# EasyEDA Pro project 一体板.epro, board PCB3
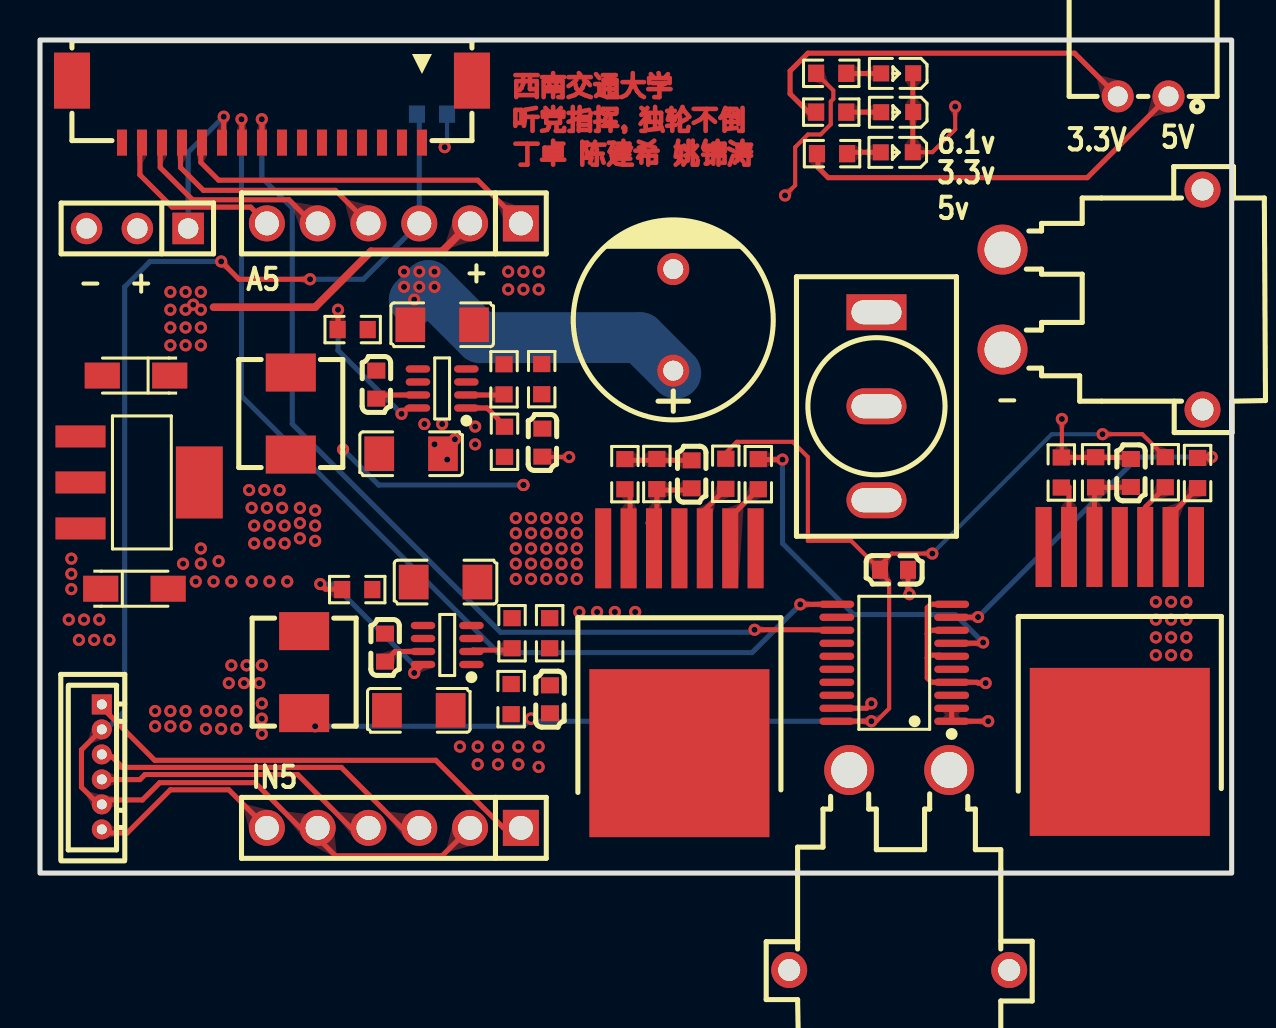
[diagram p17: board, top side]
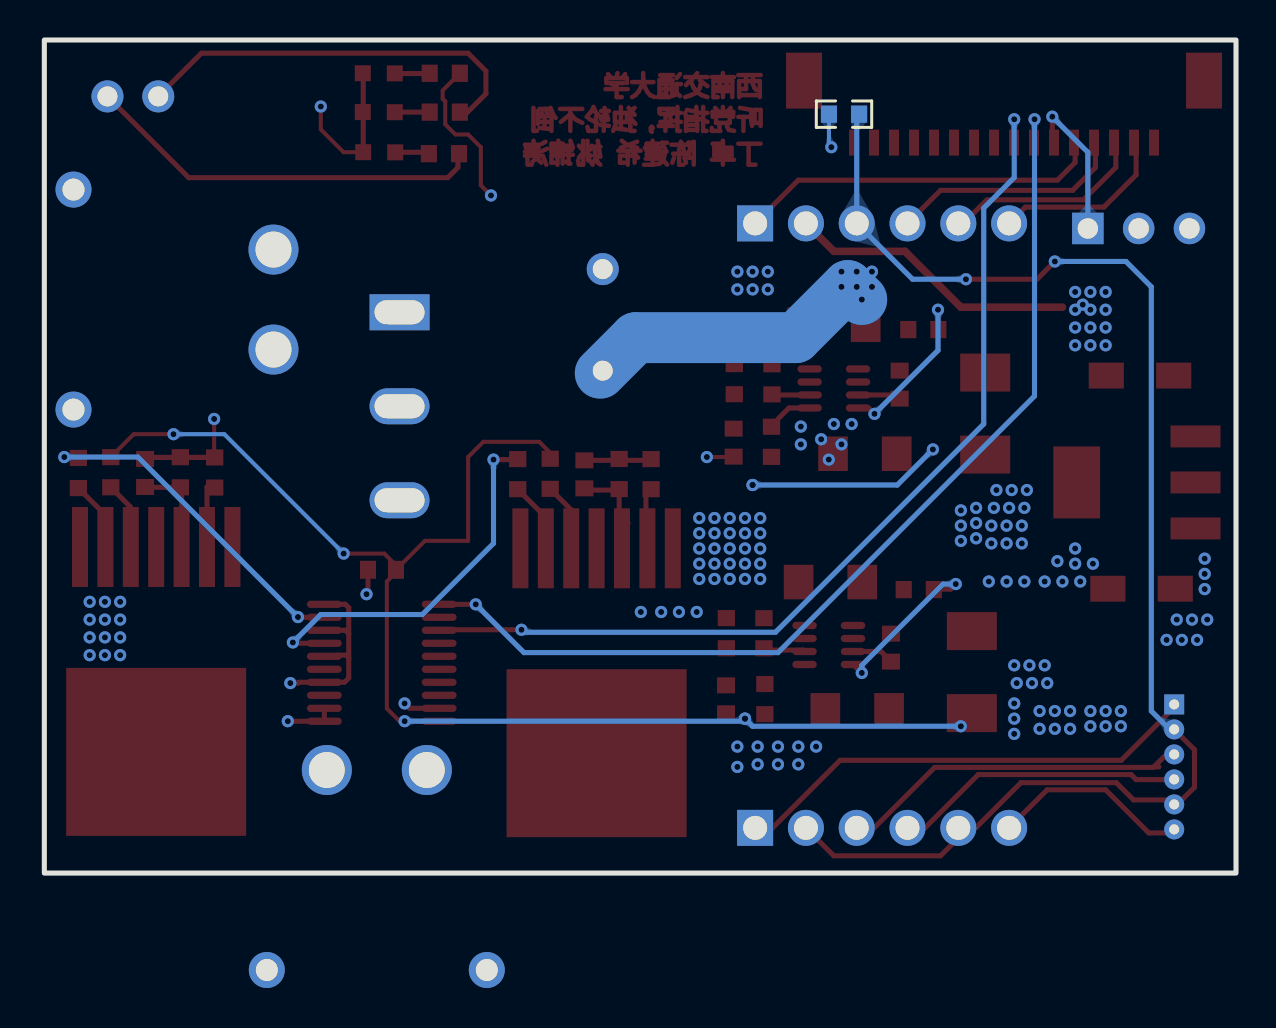
[diagram p18: board, bottom side, seen from below]

Outline 59.59 x 41.66 mm; copper layers: Top Layer, Inner1, Inner2, Bottom Layer. Coordinates in mm from the lower left corner of the outline.
Outline path: rectangle 0,41.66 59.59,0
Stack: Top Layer 0.035mm / Dielectric1 0.48mm PP er 4.5 / Inner1 0.035mm / Dielectric2 0.48mm FR4 er 4.5 / Inner2 0.035mm / Dielectric3 0.48mm PP er 4.5 / Bottom Layer 0.035mm

## Design rules (mm)
template: 自定义配置
spacing copperThickness1oz (default): track to track 0.102, other pairs 0.152 to 0.3
spacing copperThickness2oz: track to track 0.203, other pairs 0.152 to 0.3
track width copperThickness1oz (default): min 0.127, default 0.254, max 2.54
track width copperThickness2oz: min 0.203, default 0.254, max 2.54
differential pair differentialPair (default): width min 0.127, default 0.254, max 2.54; gap min 0.152, default 0.152
via viaSize (default): diameter min 0.5, default 0.61, max 10; hole min 0.3, default 0.305, max 6.3

## Placement (name value [footprint] x y rotation side)
C1  100nF  [C0603]  54.55 20.01 270 top
C2  100nF  [C0603]  32.58 19.94 270 top
C3  100nF  [C0603]  42.7 15.16 180 top
C7  220uF  [CAP-TH_BD10.0-P5.00-D1.0-FD]  31.67 27.66 90 top
C8  4.7uF  [C1206]  20.28 14.55 180 top
C9  12pF  [C0603]  25.5 8.69 270 top
C10  22uF  [C1206]  18.94 8.14 180 top
C11  10nF  [C0603]  17.25 11.27 270 top
C12  10uF  [CAP-SMD_L3.2-W1.6-RD-C7171]  4.72 14.22 0 top
C13  10uF  [CAP-SMD_L3.2-W1.6-RD-C7171]  4.8 24.88 180 top
C14  4.7uF  [C1206]  20.11 27.42 180 top
C15  12pF  [C0603]  25.12 21.52 270 top
C16  22uF  [C1206]  18.56 20.97 180 top
C17  10nF  [C0603]  16.82 24.42 270 top
CN5  XT30PW-M  [CONN-TH_XT30PW-M]  42.96 0.15 0 top
CN6  XT30PW-M  [CONN-TH_XT30PW-M]  53.13 28.68 90 top
CN14  HC-1.25-6A  [CONN-TH_6P-P1.25_HCTL_HC-1.25-6A]  3.09 5.31 270 top
CN17  XH-2AW  [CONN-TH_XH-2AW_C2908611]  55.16 38.84 180 top
FPC4  F1004-H-16-20G-R  [CONN-SMD_F1004-H-16-20G-R]  11.6 38.07 180 top
H1  Z-211-0611-0021-001  [HDR-TH_6P-P2.54-V_Z-211-0611-0021-001]  17.7 32.49 180 top
H2  Z-211-0611-0021-001  [HDR-TH_6P-P2.54-V_Z-211-0611-0021-001]  17.7 2.26 180 top
L1  4.7uH  [IND-SMD_L5.4-W5.2_FXL0530]  12.54 22.98 270 top
L2  4.7uH  [IND-SMD_L5.4-W5.2_FXL0530]  13.21 10.05 270 top
LED1  KT-0603R  [LED0603-RD]  42.84 36.04 180 top
LED2  KT-0603R  [LED0603-RD]  42.86 38.05 180 top
LED3  KT-0603R  [LED0603-RD]  42.86 39.99 180 top
P2  2.54-1*3P母  [HDR-TH_3P-P2.54-V-F]  4.87 32.23 180 top
R1  10kΩ  [R0603]  57.88 20 90 top
R3  1kΩ  [R0603]  29.25 19.95 90 top
R4  0603WAF5100T5E  [R0603]  30.84 19.95 90 top
R5  10kΩ  [R0603]  34.29 19.97 90 top
R6  10kΩ  [R0603]  35.92 19.95 90 top
R29  0Ω  [R0603]  19.6 37.95 180 bottom
R37  1kΩ  [R0603]  51.07 20.03 90 top
R38  0603WAF5100T5E  [R0603]  52.79 20.04 90 top
R39  10kΩ  [R0603]  56.27 20.04 90 top
R40  10kΩ  [R0603]  15.86 14.17 180 top
R41  47kΩ  [R0603]  23.6 11.99 270 top
R42  15kΩ  [R0603]  25.48 11.99 270 top
R43  110kΩ  [R0603]  23.56 8.7 270 top
R44  12kΩ  [R0603]  25.09 24.7 270 top
R45  10kΩ  [R0603]  15.64 27.18 180 top
R46  47kΩ  [R0603]  23.2 24.69 270 top
R48  110kΩ  [R0603]  23.23 21.57 270 top
R49  1kΩ  [R0603]  39.6 35.97 180 top
R50  1kΩ  [R0603]  39.56 38.05 180 top
R51  1kΩ  [R0603]  39.56 39.99 180 top
SW2  MT-0-103-A101-M200-RS+PJ  [SW-TH_MT-0-103-A101-M200-RS]  41.83 23.34 270 top
U29  SN74HC244PWR  [TSSOP-20_L6.5-W4.4-P0.65-LS6.4-BL]  42.71 10.52 90 top
U30  BTN8982TA  [TO-263-7_L10.2-W10.4-P1.27-LS14.4-TL]  53.99 11.18 270 top
U31  BTN8982TA  [TO-263-7_L10.2-W10.4-P1.27-LS14.4-TL]  31.97 11.12 270 top
U35  SY8303AIC  [TSOT-23-8_L2.9-W1.6-P0.65-LS2.8-BR]  20.36 11.4 0 top
U36  LM1117S-3.3  [SOT-223-3_L6.5-W3.4-P2.30-LS7.0-BR]  5 19.53 180 top
U37  SY8303AIC  [TSOT-23-8_L2.9-W1.6-P0.65-LS2.8-BR]  20.11 24.23 0 top

## Footprints (pads in the part's own frame, mm; a bottom-side part is the same pattern mirrored in y, then rotated)
C0603
  rect 0.8x0.9 smd: 1(-0.7,0) 2(0.7,0)
C1206
  rect 1.485x1.728 smd: 1(-1.593,0) 2(1.593,0)
CAP-SMD_L3.2-W1.6-RD-C7171
  rect 1.758x1.296 smd: 1(-1.687,0) 2(1.687,0)
CAP-TH_BD10.0-P5.00-D1.0-FD
  round 1.6 hole 1: 1(-2.54,0) 2(2.54,0)
CONN-SMD_F1004-H-16-20G-R
  rect 0.5x1.3 smd: 1(-7.5,1.55) 2(-6.5,1.55) 3(-5.5,1.55) 4(-4.5,1.55) 5(-3.5,1.55) 6(-2.5,1.55) 7(-1.5,1.55) 8(-0.5,1.55) 9(0.5,1.55) 10(1.5,1.55) 11(2.5,1.55) 12(3.5,1.55) 13(4.5,1.55) 14(5.5,1.55) 15(6.5,1.55) 16(7.5,1.55)
  rect 1.8x2.8 smd: 17(10,-1.55) 18(-10,-1.55)
CONN-TH_6P-P1.25_HCTL_HC-1.25-6A
  rect 1x1 hole 0.5: 1(-3.125,0)
  round 1 hole 0.5: 2(-1.875,0) 3(-0.625,0) 4(0.625,0) 5(1.875,0) 6(3.125,0)
CONN-TH_XH-2AW_C2908611
  round 1.6 hole 1: 1(-1.27,0) 2(1.27,0)
CONN-TH_XT30PW-M
  round 2.5 hole 1.8: 1(-2.5,5) 2(2.5,5)
  round 1.8 hole 1.1: 3(5.5,-5) 4(-5.5,-5)
HDR-TH_3P-P2.54-V-F
  rect 1.575x1.575 hole 1.02: 1(-2.54,0)
  round 1.575 hole 1.02: 2(0,0) 3(2.54,0)
HDR-TH_6P-P2.54-V_Z-211-0611-0021-001
  rect 1.8x1.8 hole 1.2: 1(-6.35,0)
  round 1.8 hole 1.2: 2(-3.81,0) 3(-1.27,0) 4(1.27,0) 5(3.81,0) 6(6.35,0)
IND-SMD_L5.4-W5.2_FXL0530
  rect 1.9x2.5 smd: 1(-2.05,0) 2(2.05,0)
LED0603-RD
  rect 0.8x0.8 smd: 1(-0.799,-0.004) 2(0.799,0.004)
R0603
  rect 0.806x0.864 smd: 1(-0.753,0) 2(0.753,0)
SOT-223-3_L6.5-W3.4-P2.30-LS7.0-BR
  rect 2.5x1.1 smd: 1(2.97,-2.3) 2(2.97,0) 3(2.97,2.3)
  rect 2.34x3.6 smd: 4(-2.97,0)
SW-TH_MT-0-103-A101-M200-RS
  rect 1.8x3 hole 1.2x2.5: 1(-4.7,0)
  oval 1.8x3 hole 1.2x2.5: 2(0,0) 3(4.7,0)
TO-263-7_L10.2-W10.4-P1.27-LS14.4-TL
  rect 4x0.8 smd: 1(-5.122,3.81) 2(-5.122,2.54) 3(-5.122,1.27) 4(-5.122,0) 5(-5.122,-1.27) 6(-5.122,-2.54) 7(-5.122,-3.81)
  rect 8.4x9 smd: 8(5.122,0)
TSOT-23-8_L2.9-W1.6-P0.65-LS2.8-BR
  oval 1.222x0.364 smd: 1(1.211,-0.975) 2(1.211,-0.325) 3(1.211,0.325) 4(1.211,0.975) 5(-1.211,0.975) 6(-1.211,0.325) 7(-1.211,-0.325) 8(-1.211,-0.975)
TSSOP-20_L6.5-W4.4-P0.65-LS6.4-BL
  oval 0.364x1.742 smd: 1(-2.925,-2.871) 2(-2.275,-2.871) 3(-1.625,-2.871) 4(-0.975,-2.871) 5(-0.325,-2.871) 6(0.325,-2.871) 7(0.975,-2.871) 8(1.625,-2.871) 9(2.275,-2.871) 10(2.925,-2.871) 11(2.925,2.871) 12(2.275,2.871) 13(1.625,2.871) 14(0.975,2.871) 15(0.325,2.871) 16(-0.325,2.871) 17(-0.975,2.871) 18(-1.625,2.871) 19(-2.275,2.871) 20(-2.925,2.871)

## Nets
As in the schematic.

Pads without a net: CN5 3 4; FPC4 1 2 3 4 5 6 7 8 16 17 18; U29 3 5 12 14 15 16 17 18

## Via types
v1: diameter 0.61, hole 0.305, Top Layer to Bottom Layer, 174 vias

## Routing (per net, layer and track width the routed paths; a pad name or vN(x,y) marks a point on that pad's centre or on a via; arc(x,y) is an arc through that point)
3.3V_LDO: length 89.9
  Top Layer w0.254: CN17.2 51.73,41 38.4,41 37.51,40.11 37.51,38.96 38.52,37.95
  Top Layer w0.381: H1.2 20.11,31.09 16.55,31.09 13.76,28.3 8.68,28.3
  Inner1 w2.54: 53.64,38.58 53.51,38.58 50.59,35.66 22.97,35.66 21.51,34.2 H1.2 ; 21.51,32.11 21.51,28.51 19,26.01 10.08,26.01 v1(7.66,28.42)
  vias: v1(6.52,29.06) v1(6.52,28.17) v1(6.52,27.28) v1(6.52,26.39) v1(7.28,29.06) v1(7.28,28.17) v1(7.28,27.28) v1(7.28,26.39) v1(8.04,29.06) v1(8.04,28.17) v1(8.04,27.28) v1(8.04,26.39)
5V_DCDC: length 159.3
  Top Layer w0.203: 34.33,21.06 34.84,21.56 37.63,21.56 38.4,20.8 38.4,16.61 40.56,16.61 C3.2 ; v1(53.13,21.95) 55.12,21.95 R39.2 ; 41.95,15.34 42.59,15.98 v1(44.62,15.98) ; v1(41.57,7.59) 41.83,7.59 42.46,8.23 42.46,14.58 41.95,15.09
  Top Layer w0.254: U29.20 41.57,7.59 v1(41.57,7.59) ; CN17.1 52.37,34.77 39.41,34.77 38.9,35.28 38.9,35.92
  Inner2 w2.54: CN17.1 56.3,38.71 56.3,36.8 55.54,36.04 35.98,36.04 35.48,35.53 29.89,35.53 29.89,31.53 23.04,24.69 13.33,24.69 3.6,14.96 3.6,10.39
  Bottom Layer w0.203: v1(44.62,15.98) 50.59,21.95 v1(53.13,21.95)
  Bottom Layer w0.254: v1(13.76,7.34) 24.17,7.34 v1(24.55,7.72) 24.68,7.59 v1(41.57,7.59)
  vias: v1(1.44,12.67) v1(1.57,15.72) v1(1.57,14.96) v1(1.57,14.2) v1(1.95,11.66) v1(2.2,12.67) v1(2.71,11.66) v1(2.96,12.67) v1(3.47,11.66) v1(5.76,8.1) v1(5.76,7.34) v1(6.52,8.1) v1(6.52,7.34) v1(7.28,8.1) v1(7.28,7.34) v1(8.3,8.1) v1(8.3,7.21) v1(9.06,8.1) v1(9.06,7.21) v1(9.44,9.5) v1(9.57,10.39) v1(9.82,8.1) v1(9.82,7.21) v1(10.2,9.5) v1(10.33,10.39) v1(10.96,9.5) v1(11.09,10.39) v1(11.09,8.48) v1(11.09,7.72) v1(11.09,6.96)
6.1V_DCDC: length 57.7
  Top Layer w0.203: R51.2 39.67,39.13 39.67,38.71 39.54,38.58 39.54,37.44 39.03,36.93 38.4,36.93 37.76,36.3 37.76,34.39 v1(37.25,33.88) ; v1(26.46,20.8) 25.32,20.8
  Inner1 w0.203: v1(26.46,20.8) 26.46,30.2 30.14,33.88 v1(37.25,33.88)
  Inner1 w2.54: 4.49,31.76 4.49,24.36 v1(10.58,18.26) v1(11.47,17.37)
  Bottom Layer w0.254: v1(15.16,21.18) 16.93,19.41 v1(24.17,19.41)
  vias: v1(10.46,19.15) v1(10.71,17.37) v1(10.71,16.48) v1(11.22,19.15) v1(11.35,18.26) v1(11.47,16.48) v1(11.98,19.15) v1(12.11,18.26) v1(12.23,17.37) v1(12.23,16.48) v1(13,18.26) v1(13,17.5) v1(13,16.74) v1(13.76,18.14) v1(13.76,17.37) v1(13.76,16.61)
AGND: length 70.2
  Top Layer w0.254: 2.96,3.66 5.12,3.66 5.99,4.52 10.75,4.52 13.01,2.26 H2.5 ; H2.2 20.11,0.86 14.77,0.86 13.76,1.88 ; v1(9.06,30.58) 9.95,29.69 v1(13.5,29.69) ; CN14.2 2.07,6.17 2.07,4.29 2.84,3.53
  Bottom Layer w0.254: v1(13.5,29.69) 16.17,29.69 H1.3 18.97,37.69 18.84,37.82 ; 3.22,7.09 4.23,8.1 4.23,29.31 5.5,30.58 v1(9.06,30.58)
GND: length 33.9
  Top Layer w0.203: v1(45.76,38.33) 45.76,37.19 44.62,36.05 LED1.1 ; v1(51.1,22.71) 51.1,20.81 R37.2
  Top Layer w0.254: 45,10.9 44.49,10.9 44.37,10.77 ; U29.19 41.33,8.24 v1(41.57,8.48) ; U29.8 44.54,12.14 44.37,11.97 ; 44.37,11.97 44.37,13.27 44.54,13.44 U29.10 ; 44.37,11.97 44.37,10.77 ; 44.37,10.77 44.37,9.75 44.58,9.54 U29.4 46.86,9.54 46.91,9.5 v1(47.29,9.5) ; v1(43.48,13.94) 43.4,14.02 C3.1 ; 29.13,20.55 29.21,20.64 C2.1 ; v1(47.41,7.59) 47.41,7.59 U29.1 45.59,8.18 45.64,8.23 ; R37.2 54.42,20.78 54.53,20.68 ; 43.48,40.11 43.64,39.94 LED1.1
  Bottom Layer w0.203: R29.1 20.35,36.41 v1(20.24,36.3)
  vias: v1(7.15,15.47) v1(7.79,14.58) v1(8.04,16.23) v1(8.04,15.47) v1(8.68,14.58) v1(8.93,15.6) v1(9.57,14.58) v1(10.58,14.58) v1(11.47,14.58) v1(12.36,14.58) v1(19.22,22.45) v1(19.73,21.44) v1(20.11,22.45) v1(20.36,20.68) v1(20.74,21.69) v1(21,6.32) v1(21.76,22.33) v1(21.76,21.44) v1(21.89,6.32) v1(21.89,5.44) v1(22.9,6.32) v1(22.9,5.44) v1(23.41,30.07) v1(23.41,29.18) v1(23.92,6.32) v1(23.92,5.44) v1(24.17,30.07) v1(24.17,29.18) v1(24.93,30.07) v1(24.93,29.18) v1(24.93,6.32) v1(24.93,5.31) v1(26.97,13.06) v1(27.86,13.06) v1(28.74,13.06) v1(29.76,13.06) v1(55.8,13.56) v1(55.8,12.67) v1(55.8,11.79) v1(55.8,10.9) v1(56.56,13.56) v1(56.56,12.67) v1(56.56,11.79) v1(56.56,10.9) v1(57.32,13.56) v1(57.32,12.67) v1(57.32,11.79) v1(57.32,10.9)
VCC_BAT: length 15.2
  Bottom Layer w2.54: v1(18.71,28.68) 19.41,29.38 22.01,26.77 30.01,26.77 31.79,24.99
  vias: v1(18.2,30.07) v1(18.2,29.31) v1(18.97,30.07) v1(18.97,29.31) v1(19.73,30.07) v1(19.73,29.31) v1(23.79,17.75) v1(23.79,16.99) v1(23.79,16.23) v1(23.79,15.47) v1(23.79,14.71) v1(24.55,17.75) v1(24.55,16.99) v1(24.55,16.23) v1(24.55,15.47) v1(24.55,14.71) v1(25.32,17.75) v1(25.32,16.99) v1(25.32,16.23) v1(25.32,15.47) v1(25.32,14.71) v1(26.08,17.75) v1(26.08,16.99) v1(26.08,16.23) v1(26.08,15.47) v1(26.08,14.71) v1(26.84,17.75) v1(26.84,16.99) v1(26.84,16.23) v1(26.84,15.47) v1(26.84,14.71)
A2: length 18
  Top Layer w0.254: H1.1 21.89,34.65 8.93,34.65 8.04,35.53 8.04,36.3
A3: length 11.4
  Top Layer w0.254: 7.03,36.17 7.03,35.28 8.17,34.14 14.77,34.14 H1.4
A4: length 9.5
  Top Layer w0.254: 6.01,36.35 6.01,35.28 7.63,33.67 12.45,33.67 13.38,32.74
A5: length 8.4
  Top Layer w0.254: 10.96,32.87 10.53,33.3 6.61,33.3 5,34.91 5,36.5
DIR_BRUSHED_MOTOR: length 48.8
  Top Layer w0.254: v1(11.09,37.69) 11.1,37.69 11.1,36.52 ; v1(35.73,12.17) 40.05,12.17
  Bottom Layer w0.254: v1(35.73,12.17) 35.6,12.04 23.03,12.04 12.62,22.45 12.62,33.25 11.09,34.77 v1(11.09,37.69)
IN2: length 23.7
  Top Layer w0.254: H2.1 23.17,2.26 19.79,5.64 5.74,5.64 2.89,8.48
IN3: length 17.5
  Top Layer w0.254: 4.11,5.31 3.6,5.82 3.22,5.82 ; 4.11,5.31 4.13,5.28 15.07,5.28 18.09,2.26 H2.3 ; 4.11,5.31 3.85,5.31
IN4: length 14.4
  Top Layer w0.254: 3.22,4.67 5,4.67 5.25,4.93 12.89,4.93 15.55,2.26 H2.4
IN5: length 9.7
  Top Layer w0.254: H2.6 9.44,4.17 6.52,4.17 4.36,2.01 3.34,2.01
PWM1: length 17
  Top Layer w0.254: v1(58.59,20.8) 57.95,20.8 ; U29.9 46.89,12.79 v1(46.91,12.8)
  Bottom Layer w0.254: v1(58.59,20.8) 54.91,20.8 v1(46.91,12.8)
PWM2: length 19
  Top Layer w0.254: 45.59,11.49 47.12,11.49 v1(47.16,11.53) ; v1(37.13,20.68) 35.98,20.68
  Bottom Layer w0.254: v1(47.16,11.53) 45.76,12.93 40.68,12.93 37.13,16.48 v1(37.13,20.68)
PWM_BRUSHED_MOTOR: length 51.2
  Top Layer w0.254: v1(10.08,37.69) 10.1,37.67 10.1,36.52 ; v1(38.02,13.44) 39.92,13.44
  Bottom Layer w0.254: v1(10.08,37.69) 10.08,23.85 22.9,11.02 35.6,11.02 v1(38.02,13.44)
STEERING_1: length 7.7
  Top Layer w0.254: v1(9.19,37.82) 9.19,36.61 9.1,36.52
  Bottom Layer w0.254: v1(9.19,37.82) 7.41,36.04 P2.1
$1N17060: length 3.1
  Top Layer w0.254: 51.35,19.41 51.45,19.3 U30.6
$1N17062: length 4.8
  Top Layer w0.254: R38.1 54.39,19.29 54.53,19.15 ; U30.5 52.72,19.13 52.87,19.28
$1N17063: length 2.6
  Top Layer w0.254: 55.29,17.12 55.29,18.31 R39.1
$1N17065: length 2
  Top Layer w0.254: R1.1 56.56,17.93 56.56,17.75
$1N17067: length 1.9
  Top Layer w0.254: 29.51,17.37 29.51,18.93 R3.1
$1N17069: length 3.6
  Top Layer w0.254: R4.1 30.84,17.95 30.4,17.5 ; C2.2 32.5,19.15 30.9,19.15
$1N17070: length 1.5
  Top Layer w0.254: R5.1 33.22,18.14 33.19,18.14
$1N17072: length 2.1
  Top Layer w0.254: 34.33,17.88 34.6,17.88 R6.1
$1N22931: length 8.6
  Top Layer w0.254: v1(14.01,14.45) 14.27,14.2 15.16,14.2 ; U35.8 18.73,10.01 v1(18.71,10.01)
  Bottom Layer w0.254: v1(18.71,10.01) 18.71,10.39 14.65,14.45 v1(14.01,14.45)
$1N23070: length 1.9
  Top Layer w0.254: 23.41,11.15 21.64,11.15 U35.2
$1N23414: length 2
  Top Layer w0.254: U35.7 17.75,11.08 17.31,10.64
$1N25056: length 8.5
  Top Layer w0.254: v1(18.08,22.96) 18.37,23.26 18.9,23.26 ; v1(14.9,28.17) 14.9,27.15
  Bottom Layer w0.254: v1(14.9,28.17) 14.9,26.14 v1(18.08,22.96)
$1N25058: length 1.9
  Top Layer w0.254: 21.32,23.91 23.09,23.91 23.16,23.98
$1N25059: length 1.8
  Top Layer w0.254: 21.32,23.26 22.35,23.26 22.9,22.71
$1N25062: length 1.9
  Top Layer w0.254: 17.06,23.72 17.24,23.91 U37.7
$1N27238: length 1.6
  Top Layer w0.254: LED1.2 42.04,36.04 40.43,36.04
$1N27406: length 1.8
  Top Layer w0.254: 42.08,37.95 41.98,38.05 R50.1
$1N27587: length 1.6
  Top Layer w0.254: 40.43,39.98 42.06,39.98 LED3.2

## Copper pours and planes (outline as drawn; the poured copper is in the pictures)
3.3V_LDO on Top Layer: 0.8,20.17 5.76,20.17 6.77,21.18 7.79,21.18 8.04,20.93 8.04,18.14 7.66,17.75 6.77,17.75 5.63,18.9 1.95,18.9 1.69,19.15 1.69,19.28
3.3V_LDO on Top Layer: 5.63,19.66 7.41,19.66 9.06,21.31 9.06,29.95 5.63,29.95
5V_DCDC on Top Layer: 14.39,9.25 18.33,9.25 18.33,6.45 12.87,6.45 12.87,7.72
5V_DCDC on Top Layer: 14.52,9.12 10.08,13.56 5.63,13.56 5.63,14.83 5.38,15.09 1.44,15.09 1.44,10.64 5.63,6.45 14.52,6.45
5V_DCDC on Top Layer: 22.78,8.36 22.78,7.21 26.2,7.21 26.2,8.23 26.08,8.36
5V_DCDC on Top Layer: 5.25,16.36 3.6,18.01 0.68,18.01 0.68,11.4 1.44,10.64 5.25,14.45
5V_DCDC on Inner2: 0.93,11.53 5.88,6.58 14.01,6.58 14.01,12.04 7.79,18.26 7.28,17.75 1.31,17.75 0.93,17.37
6.1V_DCDC on Top Layer: 22.65,21.44 22.65,18.64 26.08,18.64 26.08,21.18 25.82,21.44
6.1V_DCDC on Top Layer: 9.82,22.33 9.82,15.72 17.57,15.72 17.57,18.64 18.84,19.91 18.84,21.56 17.95,22.45 9.95,22.45
GND on Top Layer: 57.32,18.26 57.32,14.07 54.78,14.07 54.78,10.52 58.46,10.52 58.46,18.26
GND on Top Layer: 19.22,9.25 19.22,6.71 21.89,4.04 26.2,4.04 26.2,6.71 22.9,6.71 22.39,7.21 22.39,8.99 22.01,9.37 19.35,9.37
GND on Top Layer: 3.09,21.44 4.36,22.71 4.36,25.63 0.93,25.63 0.68,25.37 0.68,21.95 1.19,21.44
GND on Top Layer: 20.87,30.45 20.87,26.77 19.73,25.63 19.73,22.33 19.22,21.82 19.22,20.29 19.85,19.66 21.12,19.66 21.51,20.04 21.51,21.95 20.74,22.71 20.74,23.98 21,24.23 22.01,24.23 22.52,24.74 26.33,24.74 29,27.41 32.3,27.41 33.7,28.8 33.7,32.11 26.97,32.11 25.32,30.45
GND on Top Layer: 21,15.47 21,13.56 20.11,12.67 20.11,9.63 19.85,9.37 19.35,9.37 19.35,6.45 21.51,6.45 21.51,9.12 20.87,9.75 20.87,11.28 21,11.4 22.27,11.4 22.9,12.04 26.2,12.04 26.33,12.17 26.33,13.31 26.08,13.56 22.78,13.56 22.65,13.69 22.65,15.47
GND on Top Layer: 5.5,13.94 5.88,13.56 6.01,13.69 13.12,13.69 13.12,17.88 5.5,17.88
GND on Top Layer: -112.48,65.51 81.83,65.51 81.83,-27.33 -112.48,-27.33
GND on Top Layer: 18.97,18.52 22.52,18.52 22.52,22.58 22.27,22.83 18.97,22.83
GND on Top Layer: 25.82,13.56 31.16,13.56 31.41,13.31 31.41,12.55 31.16,12.29 25.06,12.29 25.06,12.8
GND on Bottom Layer: 183.18,-34.89 -11.13,-34.89 -11.13,57.95 183.18,57.95
GND on Inner1: -15.64,-29.36 -15.64,164.95 77.2,164.95 77.2,-29.36
GND on Inner2: -13.23,-129.69 -13.23,64.62 79.61,64.62 79.61,-129.69
VCC_BAT on Top Layer: 28.74,18.39 23.28,18.39 23.28,13.69 28.74,13.69
VCC_BAT on Top Layer: 19.85,12.55 20.87,13.56 20.87,14.07 17.95,14.07 17.82,14.2 17.82,12.67 18.2,12.29 19.85,12.29
VCC_BAT on Top Layer: 39.29,17.25 45.13,17.25 45.13,24.87 39.29,24.87
VCC_BAT on Top Layer: 17.95,15.47 16.04,15.47 16.04,13.56 17.95,13.56
VCC_BAT on Top Layer: 50.59,18.39 48.94,20.04 48.94,21.31 45.38,24.87 40.56,24.87 39.16,23.47 39.16,17.25 45.13,17.25 48.05,14.33 50.59,14.33
VCC_BAT on Top Layer: 17.7,18.52 17.7,13.82 17.82,13.69 20.87,13.69 20.87,15.47 21,15.6 26.71,15.6 23.92,18.39 17.82,18.39
VCC_BAT on Top Layer: 17.82,30.58 17.82,26.64 20.62,26.64 20.62,30.58
VCC_BAT on Top Layer: 15.92,28.42 19.22,28.42 19.47,28.17 19.47,24.99 18.46,24.99 17.19,26.26 15.92,26.26
VCC_BAT on Bottom Layer: 38.78,17.88 39.16,17.5 44.62,17.5 44.62,24.36 43.73,25.25 39.03,25.25 38.78,24.99
VCC_BAT on Inner1: 44.49,26.39 45.89,24.99 45.89,17.5 45.64,17.25 28.74,17.25 28.74,13.69 23.41,13.69 23.16,13.94 23.16,23.72 25.82,26.39
$1N17085 on Top Layer: 39.98,25.56 44.17,25.56 47.1,28.49 50.4,28.49 51.29,29.38 51.29,31.91 49.89,33.31 41.25,33.31 39.98,32.04
$1N17085 on Bottom Layer: 39.41,25.88 43.6,25.88 46.52,28.8 49.83,28.8 50.72,29.69 50.72,32.23 49.32,33.63 40.68,33.63 39.41,32.36
$1N17085 on Inner1: 40.11,26.33 44.3,26.33 47.22,29.25 50.52,29.25 51.41,30.14 51.41,32.68 50.02,34.07 41.38,34.07 40.11,32.8
$1N17085 on Inner2: 39.86,25.95 44.05,25.95 46.97,28.87 50.27,28.87 51.16,29.76 51.16,32.3 49.76,33.69 41.13,33.69 39.86,32.42
$1N17086 on Top Layer: 31.54,18.14 31.54,7.34 32.43,7.34 32.43,18.26 31.67,18.26
$1N17086 on Top Layer: 36.62,6.96 42.33,6.96 42.71,6.58 42.71,2.13 41.44,0.86 27.6,0.86 27.6,6.71 28.11,7.21 36.36,7.21
$1N17087 on Top Layer: 43.6,6.96 43.22,6.58 43.22,2.13 44.49,0.86 44.49,0.74 58.59,0.74 58.59,6.2 57.83,6.96
$1N17087 on Top Layer: 53.64,18.39 53.64,8.99 53.76,8.86 54.4,8.86 54.4,18.26 54.27,18.39
$1N23279 on Top Layer: 24.81,11.79 24.81,10.64 21,10.64 21,10.13 21.51,10.13 22.65,8.99 26.08,8.99 26.08,11.79
$1N25059 on Top Layer: 24.55,24.36 24.55,23.34 24.17,22.96 22.9,22.96 22.65,22.71 22.65,21.82 22.78,21.69 25.7,21.69 25.7,24.49 24.68,24.49
$1N25059 on Top Layer: 22.14,23.34 24.81,23.34 24.81,22.71 22.78,22.71
$1N25742 on Top Layer: 11.22,26.01 17.31,26.01 18.33,24.99 19.35,24.99 19.6,24.74 19.6,24.36 19.47,24.23 11.22,24.23
$1N25780 on Top Layer: 11.73,13.18 11.73,11.15 11.85,11.02 15.41,11.02 15.66,11.28 19.6,11.28 19.85,11.53 19.85,12.29 18.08,12.29 17.82,12.55 15.28,12.55 14.65,13.18

Small or netless copper shapes (teardrops, artwork), in the pictures only: 126 on Top Layer, 33 on Bottom Layer, 2 on Inner1

## Text on the board
Top Layer: 西南交通大学 / 听党指挥，独轮不倒 / 丁卓 陈建希 姚锦涛
Top Solder Mask Layer: 西南交通大学 / 听党指挥，独轮不倒 / 丁卓 陈建希 姚锦涛
Top Silkscreen Layer: - | + | A5 | IN5 | 6.1v | 3.3v | 5v | 3.3V | 5V
